# Altium schematic sheet [00] - INTERFACES_BOARD.SchDoc
size 420 x 297 mm; CompanyName: Wave; SheetNumber: 1; SheetTotal: 5; PRJ_SheetSize: A3
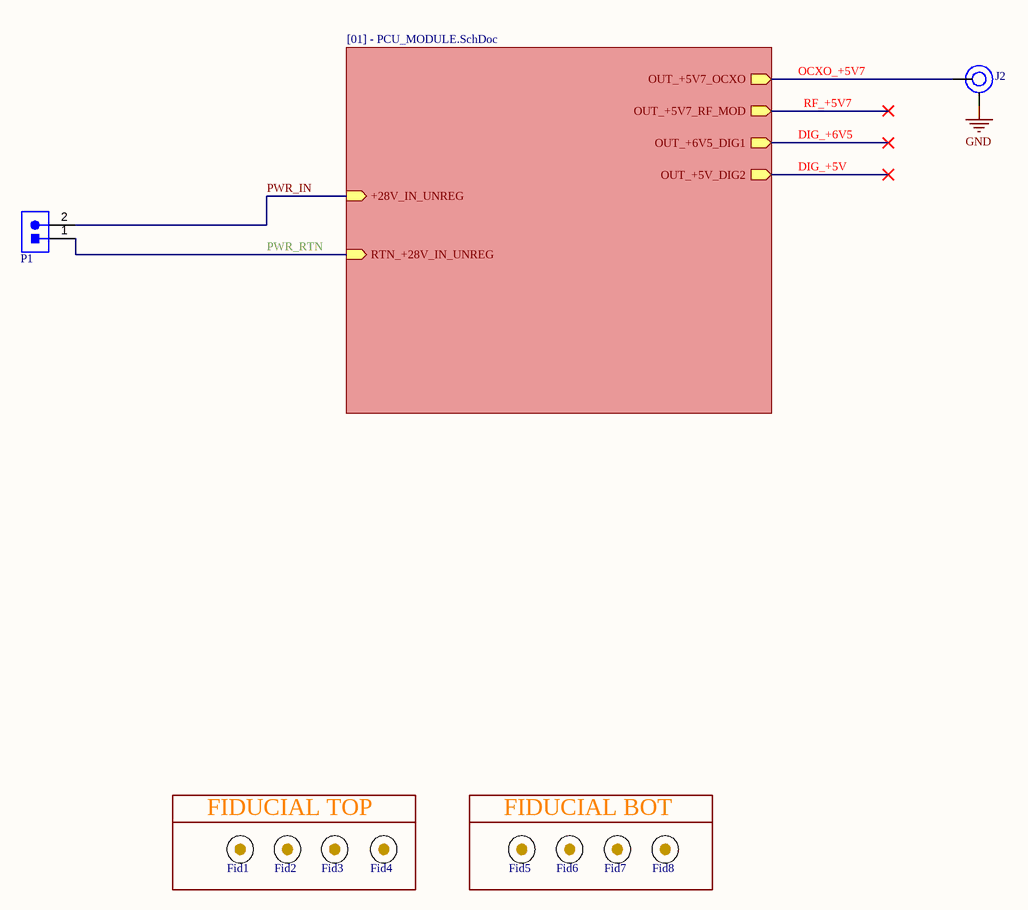
[diagram p0: [00] - INTERFACES_BOARD.SchDoc]

## Parts
Fid1  Fiducial_V2  [Fiducial]  (value not drawn)  (no BOM)
Fid2  Fiducial_V2  [Fiducial]  (value not drawn)  (no BOM)
Fid3  Fiducial_V2  [Fiducial]  (value not drawn)  (no BOM)
Fid4  Fiducial_V2  [Fiducial]  (value not drawn)  (no BOM)
Fid5  Fiducial_V2  [Fiducial]  (value not drawn)  (no BOM)
Fid6  Fiducial_V2  [Fiducial]  (value not drawn)  (no BOM)
Fid7  Fiducial_V2  [Fiducial]  (value not drawn)  (no BOM)
Fid8  Fiducial_V2  [Fiducial]  (value not drawn)  (no BOM)
J2  SMPM-PC-P-EG-ST-SM-1  [SAMTEC_SMPM-PC-P-EG-ST-SM-1]  (value not drawn)
P1  61300211121  [61300211121]  (value not drawn)

## Blocks framed on the sheet
FIDUCIAL TOP: Fid1-Fid4
FIDUCIAL BOT: Fid5-Fid8

## Sub-sheets
? = [01] - PCU_MODULE.SchDoc: RTN_+28V_IN_UNREG (in), OUT_+5V7_OCXO (out), OUT_+5V7_RF_MOD (out), OUT_+6V5_DIG1 (out), OUT_+5V_DIG2 (out), +28V_IN_UNREG (in)

## Nets
GND: J2.2
DIG_+5V: sheet /OUT_+5V_DIG2
DIG_+6V5: sheet /OUT_+6V5_DIG1
OCXO_+5V7: J2.1 ; sheet /OUT_+5V7_OCXO
PWR_IN: P1.2 ; sheet /+28V_IN_UNREG
PWR_RTN: P1.1 ; sheet /RTN_+28V_IN_UNREG
RF_+5V7: sheet /OUT_+5V7_RF_MOD

## Notes on the sheet
- Part Number:
- Description:
- Document:
- Date:
- Size:
- Sheet Title:
- Sheet
- of
- Author:
- MOD. COD.:

## Library data of the parts
Fid1-Fid8 = Fiducial_V2: Fiducial No Pin; Category: Miscellaneous
J2 = SMPM-PC-P-EG-ST-SM-1: Connector SMPM Plug Catchers Mitt 0Hz to 65GHz 50Ohm Solder Straight Surface Mount Gold; Manufacturer: Samtec; Supplier 1: mouser; Manufacturer Part Number: SMPM-PC-P-EG-ST-SM-1; RoHS: No; Category: Connectors; Stock 1: 329; Pricing 1: 1=15,71, 10=14,83, 25=14,31, 50=13,96, 100=12,66, 250=12,22, 500=11,7625 (USD); ComponentLink1URL: https://datasheet.octopart.com/SMPM-PF-P-EG-ST-SM-1-Samtec-datasheet-158267789.pdf?src-supplier=Sager+Electronics; ComponentLink1Description: https://datasheet.octopart.com/SMPM-PF-P-EG-ST-SM-1-Samtec-datasheet-158267789.pdf?src-supplier=Sager+Electronics; Supplier Part Number 1: 200-SMPM-PC-PEGSTSM1
P1 = 61300211121: THT Vertical Pin Header WR-PHD, Pitch 2.54 mm, Single Row, 2 pins; Manufacturer: Wurth Electronics; Current Rating: 3A; Voltage Rating: 250V; Number of Positions: 2; Gender: Male; Connector Type: Male Pin; Pitch: 0.1inch; Supplier 1: RSComponents; Manufacturer Part Number: 61300211121; RoHS: Yes; Category: Headers and Wire Housings; Stock 1: 1855; Pricing 1: 5=0,14100, 50=0,09700, 100=0,07800, 200=0,07300, 500=0,06800 (USD); Mount: Through Hole; Contact Plating: Gold; Housing Material: PBT; Contact Material: Copper Alloy,Copper; Color: Black; Min Operating Temperature: -40°C; Max Operating Temperature: 125°C; Number of Rows: 1; Contact Gender: Male; Packaging: Bulk; Termination: Through Hole; Number of Contacts: 2; Contact Mating Length: 0.236inch; REACH SVHC: Unknown; Lead Free: Lead Free; ComponentLink1URL: https://datasheet.ciiva.com/13619/6130xx11121-48870-13619345.pdf?src-supplier=Mouser; ComponentLink1Description: https://datasheet.ciiva.com/13619/6130xx11121-48870-13619345.pdf?src-supplier=Mouser; Supplier Part Number 1: 8281581